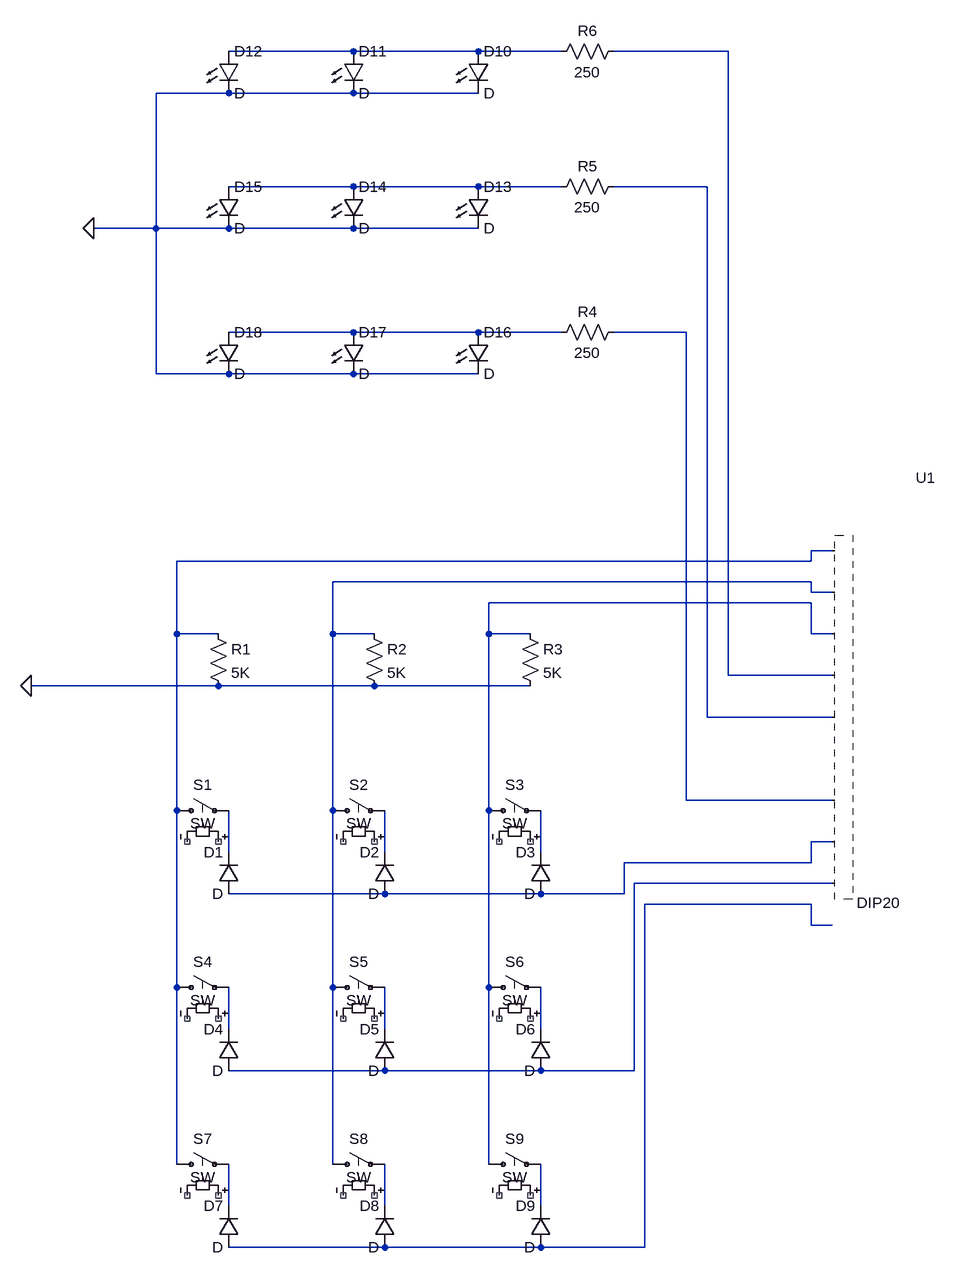
[diagram p0: schematic Key Matrix with LEDs.asc]
Key Matrix with LEDs.asc, the LTspice schematic file:
Version 4
SHEET 1 992 1060
WIRE -800 -976 -992 -976
WIRE -608 -976 -800 -976
WIRE -480 -976 -608 -976
WIRE -224 -976 -400 -976
WIRE -992 -912 -1104 -912
WIRE -800 -912 -992 -912
WIRE -608 -912 -800 -912
WIRE -800 -768 -992 -768
WIRE -608 -768 -800 -768
WIRE -480 -768 -608 -768
WIRE -256 -768 -400 -768
WIRE -1104 -704 -1104 -912
WIRE -1104 -704 -1200 -704
WIRE -992 -704 -1104 -704
WIRE -800 -704 -992 -704
WIRE -608 -704 -800 -704
WIRE -800 -544 -992 -544
WIRE -608 -544 -800 -544
WIRE -480 -544 -608 -544
WIRE -288 -544 -400 -544
WIRE -1104 -480 -1104 -704
WIRE -992 -480 -1104 -480
WIRE -800 -480 -992 -480
WIRE -608 -480 -800 -480
WIRE -64 -208 -96 -208
WIRE -96 -192 -96 -208
WIRE -96 -192 -1072 -192
WIRE -96 -160 -832 -160
WIRE -96 -144 -96 -160
WIRE -64 -144 -96 -144
WIRE -96 -128 -592 -128
WIRE -1072 -80 -1072 -192
WIRE -1008 -80 -1072 -80
WIRE -832 -80 -832 -160
WIRE -768 -80 -832 -80
WIRE -592 -80 -592 -128
WIRE -528 -80 -592 -80
WIRE -96 -80 -96 -128
WIRE -64 -80 -96 -80
WIRE -224 -16 -224 -976
WIRE -64 -16 -224 -16
WIRE -1008 0 -1296 0
WIRE -768 0 -1008 0
WIRE -528 0 -768 0
WIRE -256 48 -256 -768
WIRE -64 48 -256 48
WIRE -288 176 -288 -544
WIRE -64 176 -288 176
WIRE -1072 192 -1072 -80
WIRE -832 192 -832 -80
WIRE -592 192 -592 -80
WIRE -64 240 -96 240
WIRE -992 256 -992 192
WIRE -752 256 -752 192
WIRE -512 256 -512 192
WIRE -96 272 -96 240
WIRE -96 272 -384 272
WIRE -64 304 -368 304
WIRE -752 320 -992 320
WIRE -512 320 -752 320
WIRE -384 320 -384 272
WIRE -384 320 -512 320
WIRE -96 336 -352 336
WIRE -96 368 -96 336
WIRE -64 368 -96 368
WIRE -1072 464 -1072 192
WIRE -832 464 -832 192
WIRE -592 464 -592 192
WIRE -992 528 -992 464
WIRE -752 528 -752 464
WIRE -512 528 -512 464
WIRE -752 592 -992 592
WIRE -512 592 -752 592
WIRE -368 592 -368 304
WIRE -368 592 -512 592
WIRE -1072 736 -1072 464
WIRE -832 736 -832 464
WIRE -592 736 -592 464
WIRE -992 800 -992 736
WIRE -752 800 -752 736
WIRE -512 800 -512 736
WIRE -752 864 -992 864
WIRE -512 864 -752 864
WIRE -352 864 -352 336
WIRE -352 864 -512 864
FLAG -1296 0 0
FLAG -1200 -704 0
SYMBOL Misc\\DIP20 80 -176 R0
WINDOW 0 0 -144 Center 2
SYMATTR InstName U1
SYMBOL diode -976 320 R180
WINDOW 0 24 64 Left 2
WINDOW 3 24 0 Left 2
SYMATTR InstName D1
SYMBOL sw -1088 192 R270
WINDOW 0 24 56 VTop 2
WINDOW 3 -4 56 VBottom 2
SYMATTR InstName S1
SYMBOL diode -736 320 R180
WINDOW 0 24 64 Left 2
WINDOW 3 24 0 Left 2
SYMATTR InstName D2
SYMBOL sw -848 192 R270
WINDOW 0 24 56 VTop 2
WINDOW 3 -4 56 VBottom 2
SYMATTR InstName S2
SYMBOL diode -496 320 R180
WINDOW 0 24 64 Left 2
WINDOW 3 24 0 Left 2
SYMATTR InstName D3
SYMBOL sw -608 192 R270
WINDOW 0 24 56 VTop 2
WINDOW 3 -4 56 VBottom 2
SYMATTR InstName S3
SYMBOL diode -976 592 R180
WINDOW 0 24 64 Left 2
WINDOW 3 24 0 Left 2
SYMATTR InstName D4
SYMBOL sw -1088 464 R270
WINDOW 0 24 56 VTop 2
WINDOW 3 -4 56 VBottom 2
SYMATTR InstName S4
SYMBOL diode -736 592 R180
WINDOW 0 24 64 Left 2
WINDOW 3 24 0 Left 2
SYMATTR InstName D5
SYMBOL sw -848 464 R270
WINDOW 0 24 56 VTop 2
WINDOW 3 -4 56 VBottom 2
SYMATTR InstName S5
SYMBOL diode -496 592 R180
WINDOW 0 24 64 Left 2
WINDOW 3 24 0 Left 2
SYMATTR InstName D6
SYMBOL sw -608 464 R270
WINDOW 0 24 56 VTop 2
WINDOW 3 -4 56 VBottom 2
SYMATTR InstName S6
SYMBOL diode -976 864 R180
WINDOW 0 24 64 Left 2
WINDOW 3 24 0 Left 2
SYMATTR InstName D7
SYMBOL sw -1088 736 R270
WINDOW 0 24 56 VTop 2
WINDOW 3 -4 56 VBottom 2
SYMATTR InstName S7
SYMBOL diode -736 864 R180
WINDOW 0 24 64 Left 2
WINDOW 3 24 0 Left 2
SYMATTR InstName D8
SYMBOL sw -848 736 R270
WINDOW 0 24 56 VTop 2
WINDOW 3 -4 56 VBottom 2
SYMATTR InstName S8
SYMBOL diode -496 864 R180
WINDOW 0 24 64 Left 2
WINDOW 3 24 0 Left 2
SYMATTR InstName D9
SYMBOL sw -608 736 R270
WINDOW 0 24 56 VTop 2
WINDOW 3 -4 56 VBottom 2
SYMATTR InstName S9
SYMBOL res -1024 -96 R0
SYMATTR InstName R1
SYMATTR Value 5K
SYMBOL res -784 -96 R0
SYMATTR InstName R2
SYMATTR Value 5K
SYMBOL res -544 -96 R0
SYMATTR InstName R3
SYMATTR Value 5K
SYMBOL res -384 -560 R90
WINDOW 0 0 56 VBottom 2
WINDOW 3 32 56 VTop 2
SYMATTR InstName R4
SYMATTR Value 250
SYMBOL res -384 -784 R90
WINDOW 0 0 56 VBottom 2
WINDOW 3 32 56 VTop 2
SYMATTR InstName R5
SYMATTR Value 250
SYMBOL res -384 -992 R90
WINDOW 0 0 56 VBottom 2
WINDOW 3 32 56 VTop 2
SYMATTR InstName R6
SYMATTR Value 250
SYMBOL LED -624 -976 R0
SYMATTR InstName D10
SYMBOL LED -816 -976 R0
SYMATTR InstName D11
SYMBOL LED -1008 -976 R0
SYMATTR InstName D12
SYMBOL LED -624 -768 R0
SYMATTR InstName D13
SYMBOL LED -816 -768 R0
SYMATTR InstName D14
SYMBOL LED -1008 -768 R0
SYMATTR InstName D15
SYMBOL LED -624 -544 R0
SYMATTR InstName D16
SYMBOL LED -816 -544 R0
SYMATTR InstName D17
SYMBOL LED -1008 -544 R0
SYMATTR InstName D18

The netlist it stands for:
* Key Matrix with LEDs.asc
* U1: DIP20 (symbol Misc\DIP20 not available, pin order unknown); nets seen at it: N002, N004, N006, N007, N008, N009, N010, N014
D1 N010 N011 D
S1 N007 N011 NC_01 NC_02 SW
D2 N010 N012 D
S2 N008 N012 NC_03 NC_04 SW
D3 N010 N013 D
S3 N009 N013 NC_05 NC_06 SW
D4 N014 N016 D
S4 N007 N016 NC_07 NC_08 SW
D5 N014 N017 D
S5 N008 N017 NC_09 NC_10 SW
D6 N014 N018 D
S6 N009 N018 NC_11 NC_12 SW
D7 N015 N019 D
S7 N007 N019 NC_13 NC_14 SW
D8 N015 N020 D
S8 N008 N020 NC_15 NC_16 SW
D9 N015 N021 D
S9 N009 N021 NC_17 NC_18 SW
R1 N007 0 5K
R2 N008 0 5K
R3 N009 0 5K
R4 N006 N005 250
R5 N004 N003 250
R6 N002 N001 250
D10 N001 0 D
D11 N001 0 D
D12 N001 0 D
D13 N003 0 D
D14 N003 0 D
D15 N003 0 D
D16 N005 0 D
D17 N005 0 D
D18 N005 0 D
.model D D
.lib standard.dio
.backanno
.end